# Altium schematic sheet 01_MCU_Interface.SchDoc
size A4
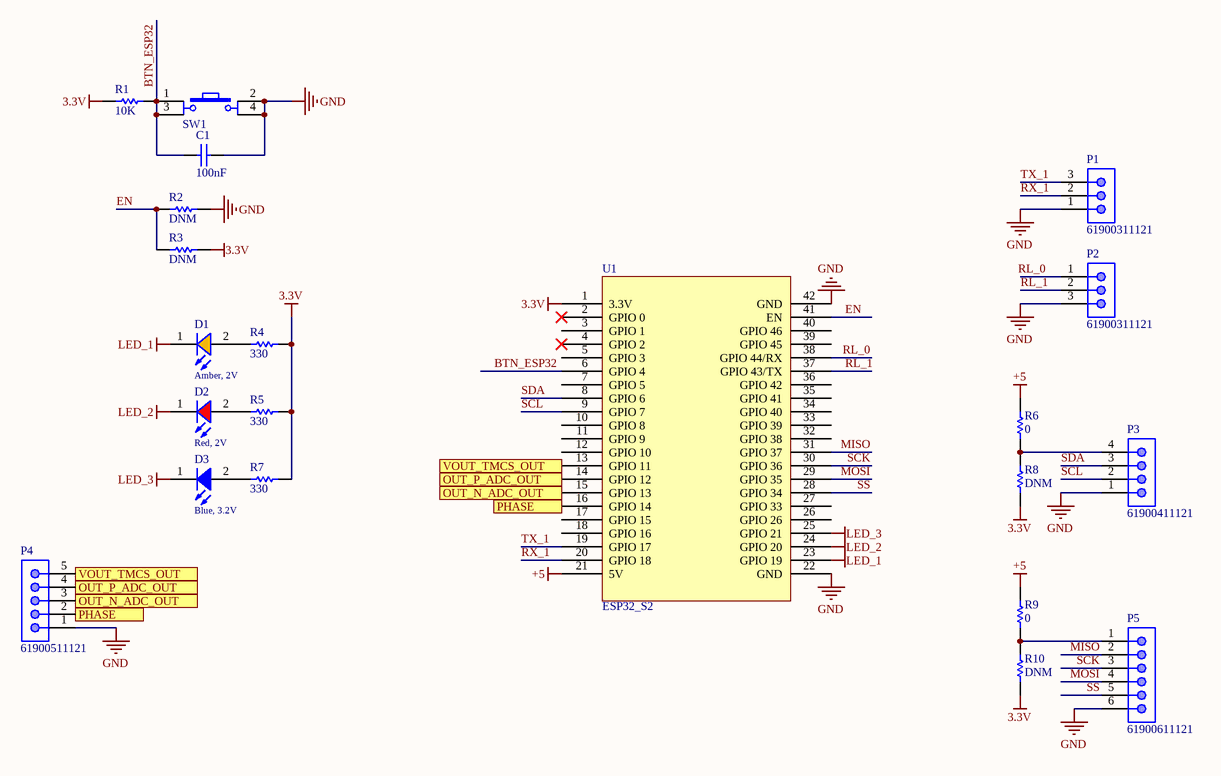
[diagram p0: 01_MCU_Interface.SchDoc]

## Parts
C1  value 100nF  [CAP-SM-0603]  (hidden comment: Cap Non-Pol SMD)
D1  Amber, 2V  [WL-SMCW_0603_H=0.7mm]
D2  Red, 2V  [WL-SMCW_0603_H=0.7mm]
D3  Blue, 3.2V  [WL-SMCW_0603_H=0.7mm]
P1  61900311121  [61900311121]
P2  61900311121  [61900311121]
P3  61900411121  [61900411121]
P4  61900511121  [61900511121]
P5  61900611121  [61900611121]
R1  value 10K  [RES-SM-0603]  (hidden comment: RESISTOR SMD)
R2  value DNM  [RES-SM-0603]  (hidden comment: RESISTOR SMD)
R3  value DNM  [RES-SM-0603]  (hidden comment: RESISTOR SMD)
R4  value 330  [RES-SM-0603]  (hidden comment: RESISTOR SMD)
R5  value 330  [RES-SM-0603]  (hidden comment: RESISTOR SMD)
R6  value 0  [RES-SM-0603]  (hidden comment: RESISTOR SMD)
R7  value 330  [RES-SM-0603]  (hidden comment: RESISTOR SMD)
R8  value DNM  [RES-SM-0603]  (hidden comment: RESISTOR SMD)
R9  value 0  [RES-SM-0603]  (hidden comment: RESISTOR SMD)
R10  value DNM  [RES-SM-0603]  (hidden comment: RESISTOR SMD)
SW1  SW  [Tact SW 4 pin]  (value not drawn)
U1  ESP32_S2  [ESP32_S2]

## Ports
OUT_N_ADC_OUT (in), OUT_N_ADC_OUT (out), OUT_P_ADC_OUT (in), OUT_P_ADC_OUT (out), PHASE (in), PHASE (out), VOUT_TMCS_OUT (in), VOUT_TMCS_OUT (out)

## Nets
3.3V: R1.1 R3.2 R4.2 R5.2 R7.2 R8.1 R10.1 U1.1(3.3V)
+5: R6.2 R9.2 U1.21(5V)
GND: C1.2 P1.1 P2.3 P3.1 P4.1 P5.6 R2.2 SW1.2 SW1.4 U1.22(GND) U1.42(GND)
LED_1: D1.1(K) U1.23(GPIO_19)
LED_2: D2.1(K) U1.24(GPIO_20)
LED_3: D3.1(K) U1.25(GPIO_21)
BTN_ESP32: C1.1 R1.2 SW1.1 SW1.3 U1.6(GPIO_4)
EN: R2.1 R3.1 U1.41(EN)
MISO: P5.2 U1.31(GPIO_37)
MOSI: P5.4 U1.29(GPIO_35)
OUT_N_ADC_OUT: P4.3 U1.15(GPIO_13) ; port OUT_N_ADC_OUT
OUT_P_ADC_OUT: P4.4 U1.14(GPIO_12) ; port OUT_P_ADC_OUT
PHASE: P4.2 U1.16(GPIO_14) ; port PHASE
RL_0: P2.1 U1.38(GPIO_44/RX)
RL_1: P2.2 U1.37(GPIO_43/TX)
RX_1: P1.2 U1.20(GPIO_18)
SCK: P5.3 U1.30(GPIO_36)
SCL: P3.2 U1.9(GPIO_7)
SDA: P3.3 U1.8(GPIO_6)
SS: P5.5 U1.28(GPIO_34)
TX_1: P1.3 U1.19(GPIO_17)
VOUT_TMCS_OUT: P4.5 U1.13(GPIO_11) ; port VOUT_TMCS_OUT
NetD1_2: D1.2(A) R4.1
NetD2_2: D2.2(A) R5.1
NetD3_2: D3.2(A) R7.1
NetP3_4: P3.4 R6.1 R8.2
NetP5_1: P5.1 R9.1 R10.2

Not connected (* = marked no-connect by the designer): U1 2(GPIO_0)* 3(GPIO_1) 4(GPIO_2)* 5(GPIO_3) 7(GPIO_5) 10(GPIO_8) 11(GPIO_9) 12(GPIO_10) 17(GPIO_15) 18(GPIO_16) 26(GPIO_26) 27(GPIO_33) 32(GPIO_38) 33(GPIO_39) 34(GPIO_40) 35(GPIO_41) 36(GPIO_42) 39(GPIO_45) 40(GPIO_46)

## Library data of the parts
C1 = Cap Non-Pol SMD: Capacitor
D1 = 150060AS75000: WL-SMCW SMT Mono-color Chip LED Waterclear, size 0603, Amber, 2V, 140deg; Chip Technology: AlInGaP; Dominant Wavelength typ.: 605nm; Luminous Intensity typ.: 130mcd; Peak Wavelength typ.: 610nm; Viewing Angle: 140deg; ComponentLink1Description: Manufacturer; ComponentLink1URL: http://www.we-online.de; ComponentLink2URL: https://www.we-online.com/catalog/datasheet/150060AS75000.pdf; ComponentLink2Description: Datasheet; Forward Voltage typ.: 2V; Emitting Color: Amber; Mounting Technology: SMT; Operating Temperature: -40 to +85degC; Published Date: December 2019; Part Number: 150060AS75000; Packaging: Tape and Reel; Size: 0603; Publisher: Wurth Elektronik
D2 = 150060RS75000: WL-SMCW SMT Mono-color Chip LED Waterclear, size 0603, Red, 2V, 140deg; Chip Technology: AlInGaP; Dominant Wavelength typ.: 625nm; Luminous Intensity typ.: 250mcd; Peak Wavelength typ.: 630nm; Viewing Angle: 140deg; ComponentLink1Description: Manufacturer; ComponentLink1URL: http://www.we-online.de; ComponentLink2URL: https://www.we-online.com/catalog/datasheet/150060RS75000.pdf; ComponentLink2Description: Datasheet; Forward Voltage typ.: 2V; Emitting Color: Red; Mounting Technology: SMT; Operating Temperature: -40 to +85degC; Published Date: December 2019; Part Number: 150060RS75000; Packaging: Tape and Reel; Size: 0603; Publisher: Wurth Elektronik
D3 = 150060BS75000: WL-SMCW SMT Mono-color Chip LED Waterclear, size 0603, Blue, 3.2V, 140deg; Chip Technology: InGaN; Dominant Wavelength typ.: 470nm; Luminous Intensity typ.: 145mcd; Peak Wavelength typ.: 465nm; Viewing Angle: 140deg; ComponentLink1Description: Manufacturer; ComponentLink1URL: http://www.we-online.de; ComponentLink2URL: https://www.we-online.com/catalog/datasheet/150060BS75000.pdf; ComponentLink2Description: Datasheet; Forward Voltage typ.: 3.2V; Emitting Color: Blue; Mounting Technology: SMT; Operating Temperature: -40 to +85degC; Published Date: December 2019; Part Number: 150060BS75000; Packaging: Tape and Reel; Size: 0603; Publisher: Wurth Elektronik
P1 P2 = 61900311121: WR-WTB THT Male Vertical Locking Header, pitch 2.54mm, 3p; Pin Number: 3; Contact Resistance: 20mOhm; Rated Current: 3A; Withstanding Voltage: 1000VAC; Working Voltage: 250VAC; ComponentLink1Description: Manufacturer; ComponentLink1URL: http://www.we-online.de; ComponentLink2Description: Datasheet; ComponentLink2URL: https://www.we-online.com/catalog/datasheet/61900311121.pdf; Pitch: 2.54mm; Published Date: January 2020; Publisher: Wurth Elektronik; Mounting Technology: THT; Packaging: Bag; Operating Temperature: -40 to +105degC; Part Number: 61900311121; Gender: Male; Type: Vertical
P3 = 61900411121: WR-WTB THT Male Vertical Locking Header, pitch 2.54mm, 4p; Pin Number: 4; Contact Resistance: 20mOhm; Rated Current: 3A; Withstanding Voltage: 1000VAC; Working Voltage: 250VAC; ComponentLink1Description: Manufacturer; ComponentLink1URL: http://www.we-online.de; ComponentLink2Description: Datasheet; ComponentLink2URL: https://www.we-online.com/catalog/datasheet/61900411121.pdf; Pitch: 2.54mm; Published Date: January 2020; Publisher: Wurth Elektronik; Mounting Technology: THT; Packaging: Bag; Operating Temperature: -40 to +105degC; Part Number: 61900411121; Gender: Male; Type: Vertical
P4 = 61900511121: WR-WTB THT Male Vertical Locking Header, pitch 2.54mm, 5p; Pin Number: 5; Contact Resistance: 20mOhm; Rated Current: 3A; Withstanding Voltage: 1000VAC; Working Voltage: 250VAC; ComponentLink1Description: Manufacturer; ComponentLink1URL: http://www.we-online.de; ComponentLink2Description: Datasheet; ComponentLink2URL: https://www.we-online.com/catalog/datasheet/61900511121.pdf; Pitch: 2.54mm; Published Date: January 2020; Publisher: Wurth Elektronik; Mounting Technology: THT; Packaging: Bag; Operating Temperature: -40 to +105degC; Part Number: 61900511121; Gender: Male; Type: Vertical
P5 = 61900611121: WR-WTB THT Male Vertical Locking Header, pitch 2.54mm, 6p; Pin Number: 6; Contact Resistance: 20mOhm; Rated Current: 3A; Withstanding Voltage: 1000VAC; Working Voltage: 250VAC; ComponentLink1Description: Manufacturer; ComponentLink1URL: http://www.we-online.de; ComponentLink2Description: Datasheet; ComponentLink2URL: https://www.we-online.com/catalog/datasheet/61900611121.pdf; Pitch: 2.54mm; Published Date: January 2020; Publisher: Wurth Elektronik; Mounting Technology: THT; Packaging: Bag; Operating Temperature: -40 to +105degC; Part Number: 61900611121; Gender: Male; Type: Vertical
R1-R10 = RESISTOR SMD: Resistor
SW1 = Tact SW - 4Pin: Switch button 4 pin; Value: Button chip 4 pin